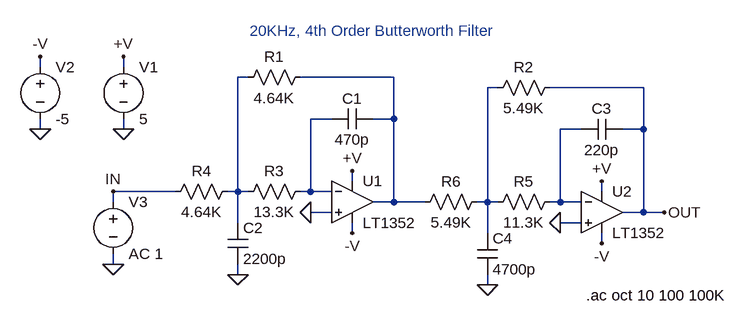
[diagram p0: schematic 1352.asc]
1352.asc, the LTspice schematic file:
Version 4
SHEET 1 896 680
WIRE -288 32 -288 16
WIRE -160 32 -160 16
WIRE 32 48 16 48
WIRE 256 48 112 48
WIRE 416 64 400 64
WIRE 640 64 496 64
WIRE 160 112 128 112
WIRE 256 112 256 48
WIRE 256 112 224 112
WIRE -288 128 -288 112
WIRE -160 128 -160 112
WIRE 544 128 512 128
WIRE 640 128 640 64
WIRE 640 128 608 128
WIRE 192 208 192 192
WIRE -80 224 -176 224
WIRE 16 224 16 48
WIRE 16 224 0 224
WIRE 32 224 16 224
WIRE 128 224 128 112
WIRE 128 224 112 224
WIRE 160 224 128 224
WIRE 576 224 576 208
WIRE -176 240 -176 224
WIRE 256 240 256 112
WIRE 256 240 224 240
WIRE 304 240 256 240
WIRE 400 240 400 64
WIRE 400 240 384 240
WIRE 416 240 400 240
WIRE 512 240 512 128
WIRE 512 240 496 240
WIRE 544 240 512 240
WIRE 160 256 128 256
WIRE 640 256 640 128
WIRE 640 256 608 256
WIRE 672 256 640 256
WIRE 16 272 16 224
WIRE 544 272 512 272
WIRE 192 288 192 272
WIRE 400 288 400 240
WIRE 576 304 576 288
WIRE -176 336 -176 320
WIRE 16 352 16 336
WIRE 400 368 400 352
FLAG -160 128 0
FLAG 192 192 +V
FLAG -160 16 +V
FLAG 192 288 -V
FLAG -288 128 0
FLAG -288 16 -V
FLAG -176 336 0
FLAG 128 256 0
FLAG 16 352 0
FLAG 576 208 +V
FLAG 576 304 -V
FLAG 512 272 0
FLAG 400 368 0
FLAG 672 256 OUT
FLAG -176 224 IN
SYMBOL voltage -160 16 R0
SYMATTR InstName V1
SYMATTR Value 5
SYMBOL voltage -288 16 R0
SYMATTR InstName V2
SYMATTR Value -5
SYMBOL res 128 32 R90
WINDOW 0 0 56 VBottom 2
WINDOW 3 32 56 VTop 2
SYMATTR InstName R1
SYMATTR Value 4.64K
SYMBOL voltage -176 224 R0
SYMATTR InstName V3
SYMATTR Value AC 1
SYMBOL cap 224 96 R90
WINDOW 0 0 32 VBottom 2
WINDOW 3 32 32 VTop 2
SYMATTR InstName C1
SYMATTR Value 470p
SYMBOL res 128 208 R90
WINDOW 0 0 56 VBottom 2
WINDOW 3 32 56 VTop 2
SYMATTR InstName R3
SYMATTR Value 13.3K
SYMBOL res 16 208 R90
WINDOW 0 0 56 VBottom 2
WINDOW 3 32 56 VTop 2
SYMATTR InstName R4
SYMATTR Value 4.64K
SYMBOL cap 0 272 R0
SYMATTR InstName C2
SYMATTR Value 2200p
SYMBOL res 512 48 R90
WINDOW 0 0 56 VBottom 2
WINDOW 3 32 56 VTop 2
SYMATTR InstName R2
SYMATTR Value 5.49K
SYMBOL cap 608 112 R90
WINDOW 0 0 32 VBottom 2
WINDOW 3 32 32 VTop 2
SYMATTR InstName C3
SYMATTR Value 220p
SYMBOL res 512 224 R90
WINDOW 0 0 56 VBottom 2
WINDOW 3 32 56 VTop 2
SYMATTR InstName R5
SYMATTR Value 11.3K
SYMBOL res 400 224 R90
WINDOW 0 0 56 VBottom 2
WINDOW 3 32 56 VTop 2
SYMATTR InstName R6
SYMATTR Value 5.49K
SYMBOL cap 384 288 R0
SYMATTR InstName C4
SYMATTR Value 4700p
SYMBOL opamps\\LT1352 192 176 R0
SYMATTR InstName U1
SYMBOL opamps\\LT1352 576 192 R0
SYMATTR InstName U2
TEXT 552 384 Left 2 !.ac oct 10 100 100K
TEXT 224 -8 Bottom 2 ;20KHz, 4th Order Butterworth Filter

The netlist it stands for:
* 1352.asc
V1 +V 0 5
V2 -V 0 -5
R1 N002 N001 4.64K
V3 IN 0 AC 1
C1 N002 N004 470p
R3 N004 N001 13.3K
R4 N001 IN 4.64K
C2 N001 0 2200p
R2 OUT N003 5.49K
C3 OUT N005 220p
R5 N005 N003 11.3K
R6 N003 N002 5.49K
C4 N003 0 4700p
XU1 0 N004 +V -V N002 LT1352  ; pins In+ In- V+ V- OUT
XU2 0 N005 +V -V OUT LT1352  ; pins In+ In- V+ V- OUT
.ac oct 10 100 100K
* 20KHz, 4th Order Butterworth Filter
.lib LTC.lib
.backanno
.end